# Altium schematic sheet Altium_Circuit_1_v03_02_PROTOCOL_ANALYZER_DUINO_4Plane.schdoc
size 309 x 223 mm; Symbol: Sheet-Symbol_A4; Device: Sheet-Symbol_A4; @Project Name: The20c_v03; @Page Count: 1; @Update Date: 2025-04-01; @Create Date: 2024-08-29; @Schematic Name: v03_PROTOCOL_ANALYZER_DUINO_4Plane; @Page No: 1; @Page Name: v03_PROTOCOL_ANALYZER_DUINO_4Plane; Company: OsoLabs.tech; Reviewed: OsoLabs.tech; Version: V03.0; Page Size: A4; Part Number: 20c100; Drawn: OsoLabs.tech; @Board Name: v03_PROTOCOL_ANALYZER_DUINO_4Plane; @Create Time: 14:28:09; @Update Time: 14:07:00
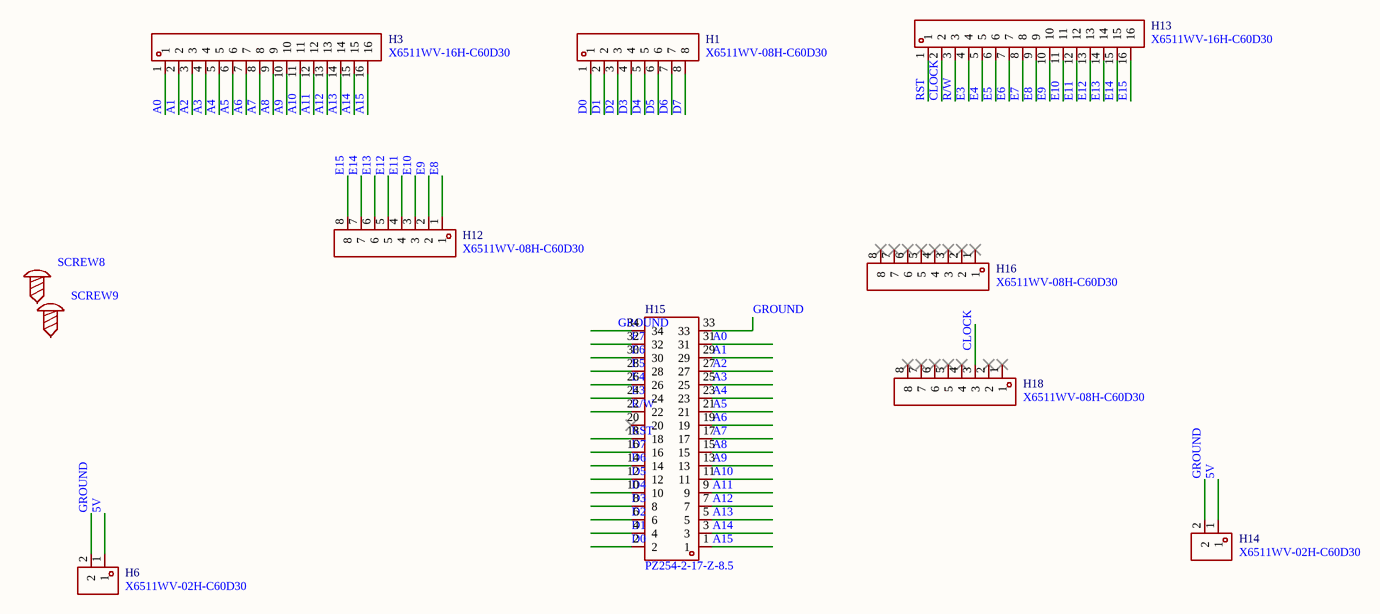
[diagram p0: Altium_Circuit_1_v03_02_PROTOCOL_ANALYZER_DUINO_4Plane.schdoc]

## Parts
H1  X6511WV-08H-C60D30  [HDR-TH_8P-P2.54-V-M]
H3  X6511WV-16H-C60D30  [HDR-TH_16P-P2.54-V-M]
H6  X6511WV-02H-C60D30  [HDR-TH_2P-P2.54-V-M]
H12  X6511WV-08H-C60D30  [HDR-TH_8P-P2.54-V-M]
H13  X6511WV-16H-C60D30  [HDR-TH_16P-P2.54-V-M]
H14  X6511WV-02H-C60D30  [HDR-TH_2P-P2.54-V-M]
H15  PZ254-2-17-Z-8.5  [HDR-TH_34P-P2.54-V-M-R2-C17-S2.54]
H16  X6511WV-08H-C60D30  [HDR-TH_8P-P2.54-V-M]
H18  X6511WV-08H-C60D30  [HDR-TH_8P-P2.54-V-M]
SCREW8  (no value)  [Screw-Hole-M3]
SCREW9  (no value)  [Screw-Hole-M3]

## Nets
5V: H6.1 H14.1
A0: H3.1 H15.31
A1: H3.2 H15.29
A2: H3.3 H15.27
A3: H3.4 H15.25
A4: H3.5 H15.23
A5: H3.6 H15.21
A6: H3.7 H15.19
A7: H3.8 H15.17
A8: H3.9 H15.15
A9: H3.10 H15.13
A10: H3.11 H15.11
A11: H3.12 H15.9
A12: H3.13 H15.7
A13: H3.14 H15.5
A14: H3.15 H15.3
A15: H3.16 H15.1
CLOCK: H13.2 H18.3
D0: H1.1 H15.2
D1: H1.2 H15.4
D2: H1.3 H15.6
D3: H1.4 H15.8
D4: H1.5 H15.10
D5: H1.6 H15.12
D6: H1.7 H15.14
D7: H1.8 H15.16
E3: H13.4 H15.24
E4: H13.5 H15.26
E5: H13.6 H15.28
E6: H13.7 H15.30
E7: H13.8 H15.32
E8: H12.1 H13.9
E9: H12.2 H13.10
E10: H12.3 H13.11
E11: H12.4 H13.12
E12: H12.5 H13.13
E13: H12.6 H13.14
E14: H12.7 H13.15
E15: H12.8 H13.16
GROUND: H6.2 H14.2 H15.33 H15.34
R/W: H13.3 H15.22
RST: H13.1 H15.18

Not connected (* = marked no-connect by the designer): H15 20*; H16 1* 2* 3* 4* 5* 6* 7* 8*; H18 1* 2* 4* 5* 6* 7* 8*; SCREW8 1; SCREW9 1

## Notes on the sheet
- 1
- 2
- 3
- 4
- 5
- 6
- A
- B
- C
- Schematic
- v03_PROTOCOL_ANALYZER_DUINO_4Plane
- Create Date
- Update Date
- 2025-04-01
- 2024-08-29
- Reviewed
- Drawn
- Page
- OsoLabs.tech
- Part Number
- The20c_v03
- 20c100
- D
- VER
- SIZE
- PAGE
- OF
- V03.0
- A4

## Library data of the parts
H1 H12 H16 H18 = X6511WV-08H-C60D30: Manufacturer: XKB Connection(中国星坤); Symbol: X6511WV-08H-C30D60; Add into BOM: yes; Pin Structure: 1x8P; Pitch: 2.54mm; Circluar Pins/Square Pins: Square Pins; Current Rating (Max): 3A; Voltage Rating (Max): 250V; Soldering Temperature(Max): 260℃; Device: X6511WV-08H-C60D30; LCSC Part Name: 1x8P 间距:2.54mm 方针; Supplier Part: C706880; Manufacturer Part: X6511WV-08H-C60D30; Supplier Footprint: 插件,P=2.54mm; JLCPCB Part Class: Extended Part; Datasheet: https://atta.szlcsc.com/upload/public/pdf/source/20230809/5CB1BA18DEB4F0D0A9424EAE32735233.pdf; Supplier: LCSC; Convert to PCB: yes; Row Spacing: 2.54mm; Mounting Type: -; Number of Rows: Plugin; Number of Pins: 8P; Length of Mating Pin: -; Insulation Height: 2.5mm; Length of End Connection Pin: -; Contact Plating: Gold; Operating Temperature Range: -40℃~+105℃; Color: Black
H3 H13 = X6511WV-16H-C60D30_C725948: Manufacturer: XKB Connection(中国星坤); Symbol: X6511WV-16H-C30D60; Add into BOM: yes; Pin Structure: 1x16P; Pitch: 2.54mm; Circluar Pins/Square Pins: Square Pins; Current Rating (Max): 3A; Voltage Rating (Max): 250V; Soldering Temperature(Max): 260℃; Device: X6511WV-16H-C60D30_C725948; LCSC Part Name: 1x16P 间距:2.54mm 方针; Supplier Part: C725948; Manufacturer Part: X6511WV-16H-C60D30; Supplier Footprint: 插件,P=2.54mm; JLCPCB Part Class: Extended Part; Datasheet: https://atta.szlcsc.com/upload/public/pdf/source/20230721/A16D430B34E2E138DC069227312AB7CE.pdf; Supplier: LCSC; Convert to PCB: yes; Row Spacing: 2.54mm; Mounting Type: -; Number of Rows: Plugin; Number of Pins: 16P; Length of Mating Pin: -; Insulation Height: 2.5mm; Length of End Connection Pin: -; Contact Plating: Gold; Operating Temperature Range: -40℃~+105℃; Color: Black
H6 H14 = X6511WV-02H-C60D30: Manufacturer: XKB Connection(中国星坤); Symbol: X6511WV-02H-C30D60; Add into BOM: yes; Pin Structure: 1x2P; Pitch: 2.54mm; Circluar Pins/Square Pins: Square Pins; Current Rating (Max): 3A; Voltage Rating (Max): 250V; Soldering Temperature(Max): 260℃; Device: X6511WV-02H-C60D30; LCSC Part Name: 1x2P 间距:2.54mm 方针; Supplier Part: C706874; Manufacturer Part: X6511WV-02H-C60D30; Supplier Footprint: 插件,P=2.54mm; JLCPCB Part Class: Extended Part; Supplier: LCSC; Convert to PCB: yes; Row Spacing: 2.54mm; Mounting Type: -; Number of Rows: Plugin; Number of Pins: 2P; Length of Mating Pin: -; Insulation Height: 2.5mm; Length of End Connection Pin: -; Contact Plating: Gold; Operating Temperature Range: -40℃~+105℃; Color: Black
H15 = PZ254-2-17-Z-8.5: Manufacturer: HCTL(华灿天禄); Add into BOM: yes; Pin Structure: 2x17P; Pitch: 2.54mm; Circluar Pins/Square Pins: Square Pins; Current Rating (Max): 3A; Soldering Temperature(Max): 260℃@10S; Symbol: PZ254-2-17-Z-8.5; Device: PZ254-2-17-Z-8.5; LCSC Part Name: 2x17P 间距:2.54mm 方针 直插; Supplier Part: C2894978; Manufacturer Part: PZ254-2-17-Z-8.5; Supplier Footprint: 插件,P=2.54mm; JLCPCB Part Class: Extended Part; Datasheet: https://atta.szlcsc.com/upload/public/pdf/source/20230609/5BA09C8BEB9B31376F8BF6032FF67CAC.pdf; Supplier: LCSC; Convert to PCB: yes; Row Spacing: 2.54mm; Mounting Type: Straight; Number of Rows: 双排; Number of Pins: 34P; Voltage Rating (Max): -; Length of Mating Pin: 6mm; Insulation Height: 2.5mm; Length of End Connection Pin: 3mm; Operating Temperature Range: -40℃~+105℃; Color: Black
SCREW8 SCREW9 = Screw-Hole-M3: Convert to PCB: yes; Symbol: Screw-Hole; Device: Screw-Hole-M3; Add into BOM: yes; Supplier Footprint: 插件